# Altium schematic sheet PHY.SchDoc
size A; SheetNumber: 5; SheetTotal: 6
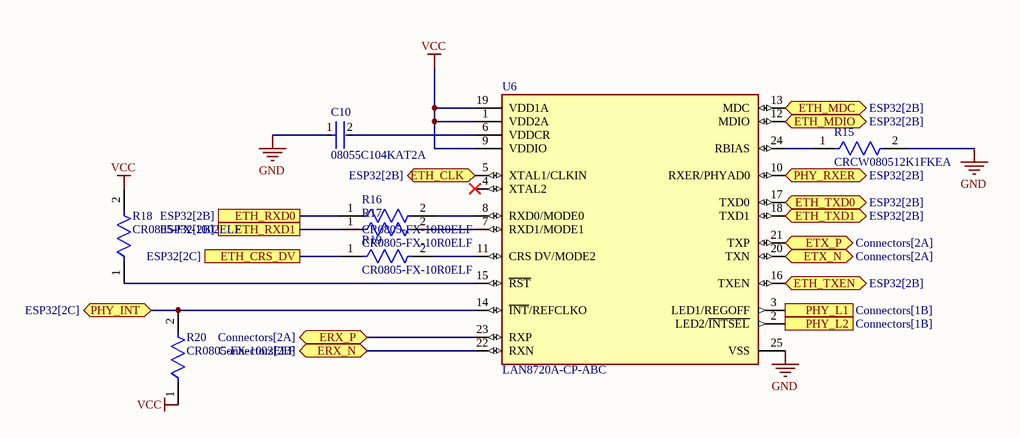
[diagram p0: PHY.SchDoc]

## Parts
C10  08055C104KAT2A  [FP-0805-L_2_01_0_2-W_1_25-IPC_C]
R15  CRCW080512K1FKEA  [FP-CRCW0805-e3-IPC_B]
R16  CR0805-FX-10R0ELF  [FP-CR0805-IPC_B]
R17  CR0805-FX-10R0ELF  [FP-CR0805-IPC_B]
R18  CR0805-FX-1002ELF  [FP-CR0805-IPC_A]
R19  CR0805-FX-10R0ELF  [FP-CR0805-IPC_B]
R20  CR0805-FX-1002ELF  [FP-CR0805-IPC_A]
U6  LAN8720A-CP-ABC  [FP-24-S4QFN-4x4B-0_5P-IPC_B]

## Ports
ERX_N (bidir, see Connectors[2B]), ERX_P (bidir, see Connectors[2A]), ETH_CLK (bidir, see ESP32[2B]), ETH_CRS_DV (see ESP32[2C]), ETH_MDC (bidir, see ESP32[2B]), ETH_MDIO (bidir, see ESP32[2B]), ETH_RXD0 (see ESP32[2B]), ETH_RXD1 (see ESP32[2B]), ETH_TXD0 (bidir, see ESP32[2B]), ETH_TXD1 (bidir, see ESP32[2B]), ETH_TXEN (bidir, see ESP32[2B]), ETX_N (bidir, see Connectors[2A]), ETX_P (bidir, see Connectors[2A]), PHY_INT (bidir, see ESP32[2C]), PHY_L1 (out, see Connectors[1B]), PHY_L2 (out, see Connectors[1B]), PHY_RXER (bidir, see ESP32[2B])

## Nets
GND: C10.1 R15.2 U6.25(VSS)
VCC: R18.2 R20.1 U6.1(VDD2A) U6.9(VDDIO) U6.19(VDD1A)
ERX_N: U6.22(RXN) ; port ERX_N
ERX_P: U6.23(RXP) ; port ERX_P
ETH_CLK: U6.5(XTAL1/CLKIN) ; port ETH_CLK
ETH_CRS_DV: R19.1 ; port ETH_CRS_DV
ETH_MDC: U6.13(MDC) ; port ETH_MDC
ETH_MDIO: U6.12(MDIO) ; port ETH_MDIO
ETH_RXD0: R16.1 ; port ETH_RXD0
ETH_RXD1: R17.1 ; port ETH_RXD1
ETH_TXD0: U6.17(TXD0) ; port ETH_TXD0
ETH_TXD1: U6.18(TXD1) ; port ETH_TXD1
ETH_TXEN: U6.16(TXEN) ; port ETH_TXEN
ETX_N: U6.20(TXN) ; port ETX_N
ETX_P: U6.21(TXP) ; port ETX_P
PHY_INT: R20.2 U6.14(~{INT}/REFCLKO) ; port PHY_INT
PHY_L1: U6.3(LED1/REGOFF) ; port PHY_L1
PHY_L2: U6.2(LED2/~{INTSEL}) ; port PHY_L2
PHY_RXER: U6.10(RXER/PHYAD0) ; port PHY_RXER
NetC10_2: C10.2 U6.6(VDDCR)
NetR15_1: R15.1 U6.24(RBIAS)
NetR16_2: R16.2 U6.8(RXD0/MODE0)
NetR17_2: R17.2 U6.7(RXD1/MODE1)
NetR18_1: R18.1 U6.15(~{RST})
NetR19_2: R19.2 U6.11(CRS_DV/MODE2)

Not connected (* = marked no-connect by the designer): U6 4(XTAL2)*

## Library data of the parts
C10 = CMP-2000-05016-2: General Purpose Ceramic Capacitor, 0805, 100nF, 10%, X7R, 0.15, 50V; Dissipation Factor: 2.5%; Insulation Resistance: 100GR; Voltage Rating (DC): 50V; Package Quantity: 4000; Tolerance: 10%; Voltage Rating: 50V; Dielectric: X7R; Case/Package: 0805; Lead Free: Lead Free; Dielectric Material: Ceramic; Thickness: 0.037inch; Weight: 0.001411oz; Max Operating Temperature: 125°C; REACH SVHC: No SVHC; Mount: Surface Mount; RoHS Compliant: Yes; Depth: 1.25mm; Height: 0.5mm; Case Code (Metric): 2012; Length: 2mm; Termination: Standard; Case Code (Imperial): 0805; Number of Pins: 2; Voltage: 50V; Radiation Hardening: No; Min Operating Temperature: -55°C; Capacitance: 100nF; Width: 1.2mm; Series: MLCC X7R; Packaging: Cut Tape
R15 = CMP-2001-04935-2: RES Thick Film, 12.1kΩ, 1%, 0.125W, 100ppm/°C, 0805; Max Power Dissipation: 125mW; Resistance: 12.1kR; Voltage Rating: 150V; Min Operating Temperature: -55°C; Power Rating: 125mW; Length: 2mm; Tolerance: 1%; Termination: SMD/SMT; Height: 0.45mm; Radiation Hardening: No; Case/Package: 0805; Packaging: Tape and Reel; Lead Free: Lead Free; Military Standard: Not; Max Operating Temperature: 155°C; Features: Automotive AEC-Q200; Voltage Rating (DC): 150V; Width: 0.049inch; Case Code (Imperial): 0805; Depth: 1.25mm; Temperature Coefficient: 100ppm/°C; Weight: 0.000194oz; Composition: Thick Film; Case Code (Metric): 2012; Number of Terminations: 2; Package Quantity: 10; Contact Plating: Tin
R16 R17 R19 = CMP-07231-004657-1: Thick Film Chip Resistors 0805 10Ω 0.125W 1% 100ppm/°C; Voltage Rating (DC): 150V; Resistance: 10R; Power Rating: 125mW; Tolerance: 1%; Min Operating Temperature: -55°C; Length: 2mm; Case Code (Metric): 2012; Temperature Coefficient: 100ppm/°C; Height: 0.5mm; Max Operating Temperature: 155°C; Case/Package: 0805; Width: 1.25mm; Composition: Thick Film; Contact Plating: Tin; Termination: SMD/SMT; Packaging: Tape and Reel; REACH SVHC: No SVHC; Number of Pins: 2; Package Quantity: 5000; Mount: Surface Mount; Military Standard: Not; Thickness: 508um; Case Code (Imperial): 0805; Depth: 1.25mm; Radiation Hardening: No; Voltage Rating: 150V
R18 R20 = CMP-07231-003204-1: Thick Film Chip Resistors 0805 10kΩ 0.125W 1% 100ppm/°C; Max Power Dissipation: 125mW; Voltage Rating: 150V; Voltage Rating (DC): 100V; Resistance: 10kR; Height: 0.5mm; Tolerance: 1%; Max Operating Temperature: 155°C; Thickness: 508um; Radiation Hardening: No; Packaging: Tape and Reel; Depth: 1.25mm; Contact Plating: Tin; Package Quantity: 1; Case Code (Metric): 2012; REACH SVHC: No SVHC; Min Operating Temperature: -55°C; Power Rating: 125mW; Mount: Surface Mount; Length: 2mm; Case Code (Imperial): 0805; Width: 1.25mm; Temperature Coefficient: 100ppm/°C; Termination: SMD/SMT; Composition: Thick Film; Features: Moisture Resistant; Case/Package: 0805; Number of Terminations: 2
U6 = CMP-06281-000057-1: IC TRANSCEIVER FULL 2/2 24SQFN